# Altium schematic sheet camera.SchDoc
size A3
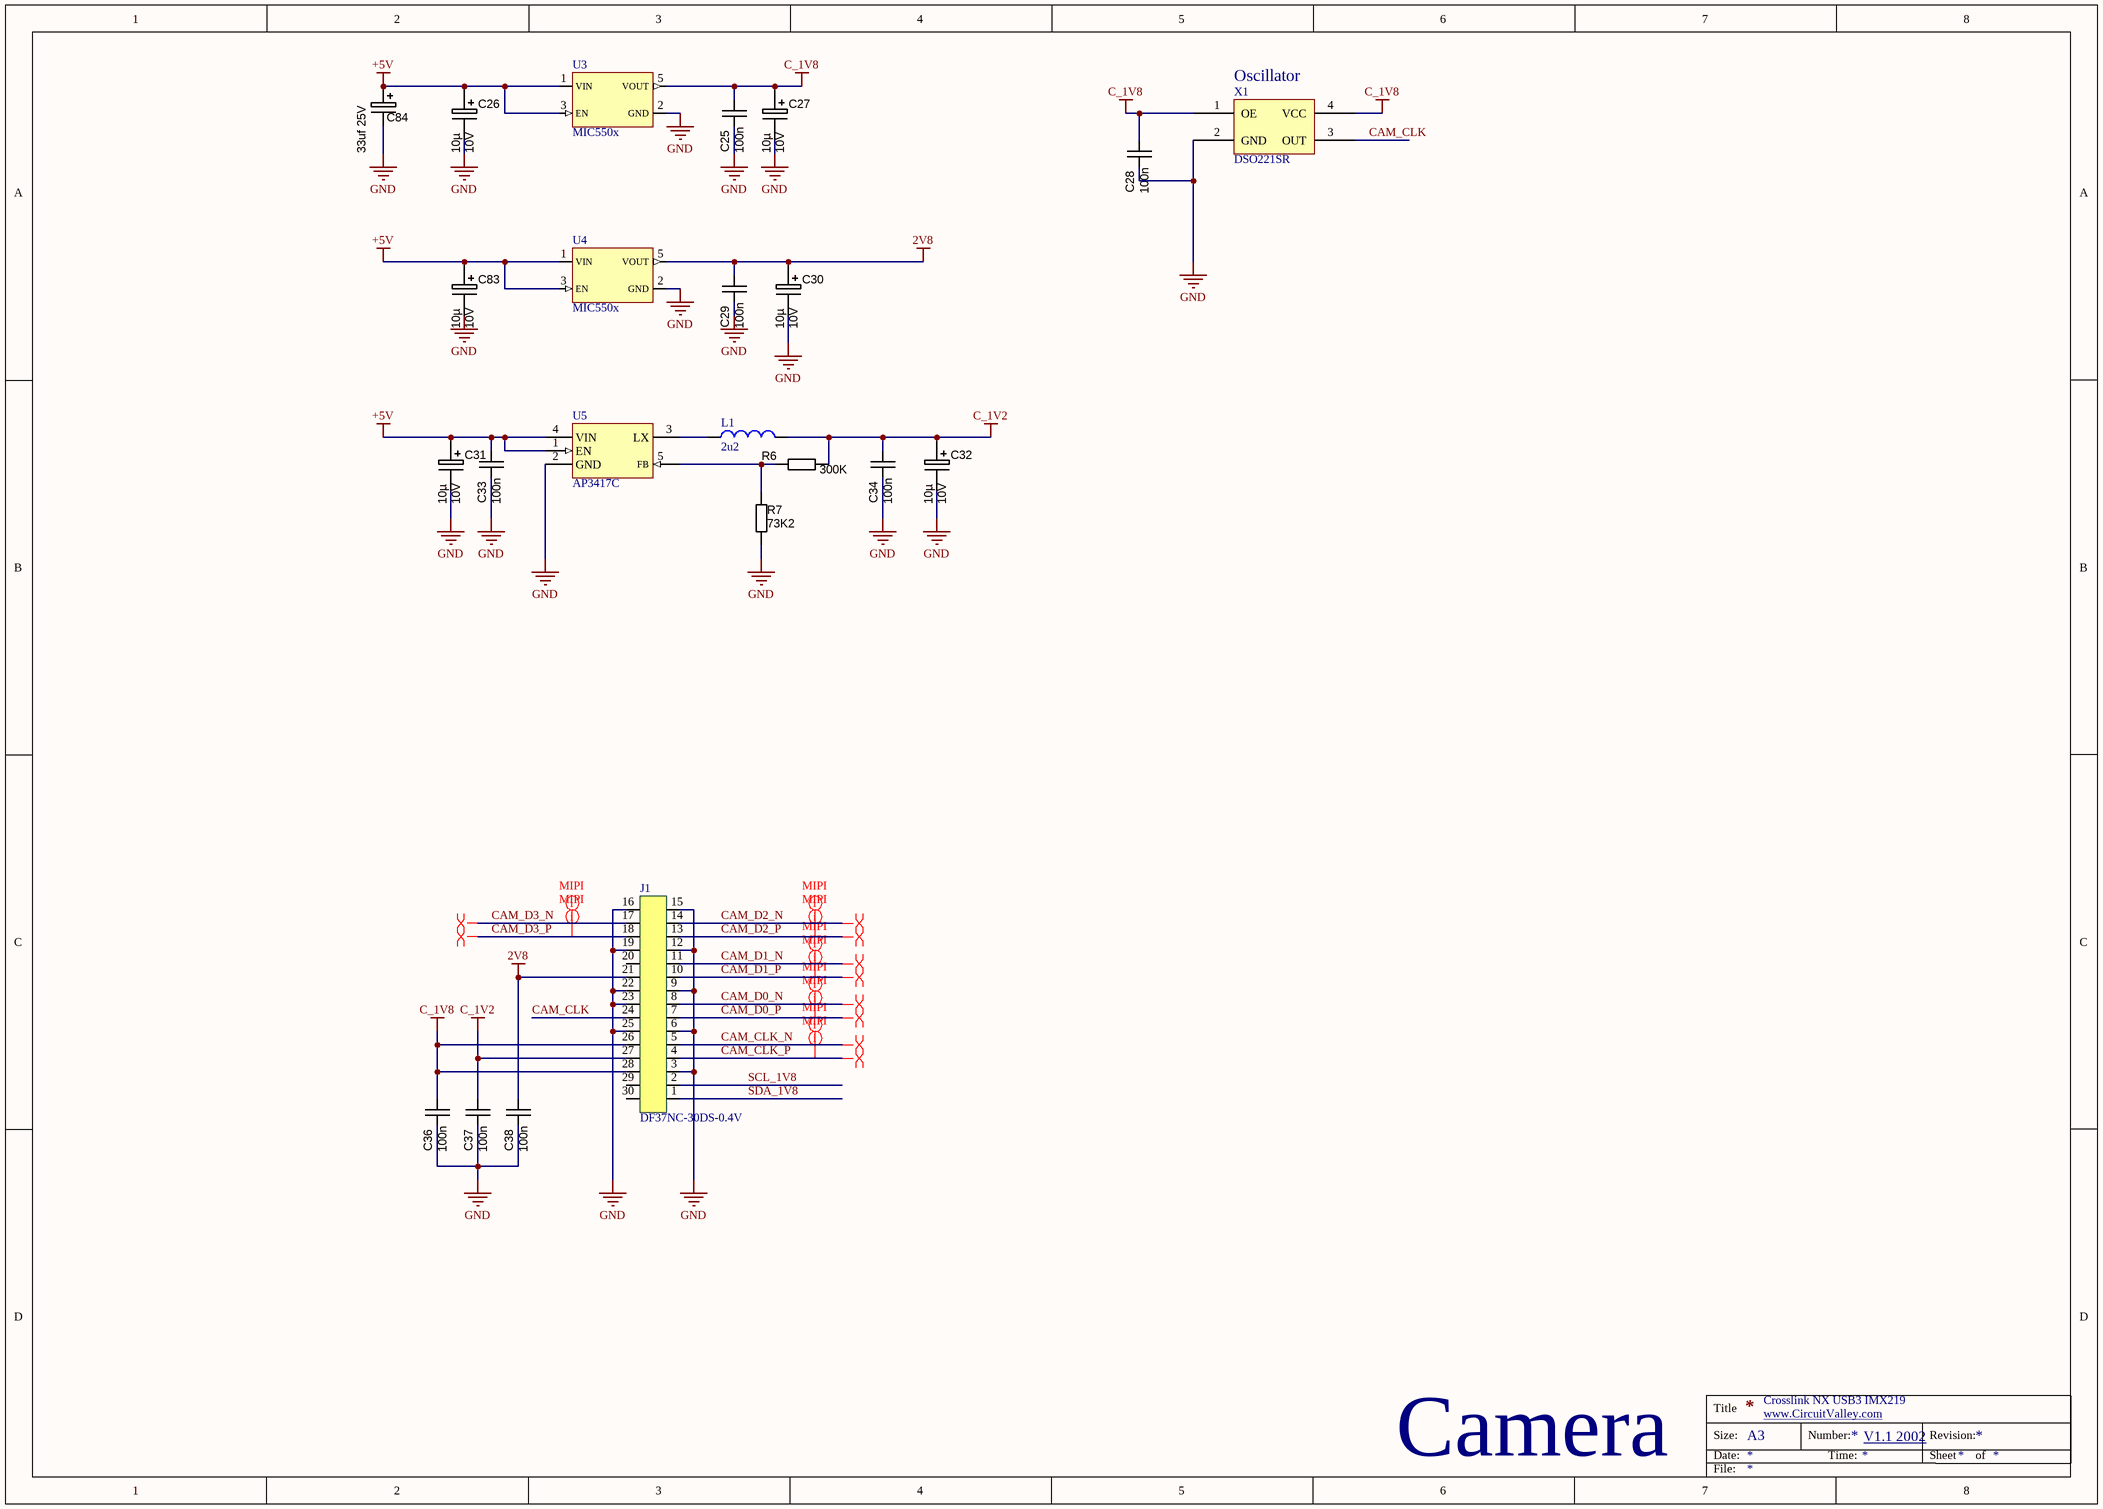
[diagram p0: camera.SchDoc]

## Parts
C25  100n  [CAPC1608N]
C26  Ratings: 10V  [CAPMP3528X210N]  (hidden comment: 10µ)
C27  Ratings: 10V  [CAPMP3528X210N]  (hidden comment: 10µ)
C28  100n  [CAPC1608N]
C29  100n  [CAPC1608N]
C30  Ratings: 10V  [CAPMP3528X210N]  (hidden comment: 10µ)
C31  Ratings: 10V  [CAPMP3528X210N]  (hidden comment: 10µ)
C32  Ratings: 10V  [CAPMP3528X210N]  (hidden comment: 10µ)
C33  100n  [CAPC1608N]
C34  100n  [CAPC1608N]
C36  100n  [CAPC1608N]
C37  100n  [CAPC1608N]
C38  100n  [CAPC1608N]
C83  Ratings: 10V  [CAPMP3528X210N]  (hidden comment: 10µ)
C84  value 33uf 25V  [CAPMP7343X310N]  (hidden comment: 33uf 20V D)
J1  DF37NC-30DS-0.4V  [DF37NC-30DS-0.4V]
L1  2u2  [TAIYO_NRS4018T2R2MDGJ]
R6  value 300K  [RESC1608N_ZERO]  (hidden comment: Thick Film)
R7  value 73K2  [RESC1608N_ZERO]  (hidden comment: Thick Film)
U3  MIC550x  [SOT23-5]
U4  MIC550x  [SOT23-5]
U5  AP3417C  [SOT23-5]
X1  DSO221SR  [Active Oscillator 2520]

## Nets
2V8: C29.2 C30.1 C38.2 J1.21 U4.5(VOUT)
+5V: C26.1 C31.1 C33.2 C83.1 C84.1 U3.1(VIN) U3.3(EN) U4.1(VIN) U4.3(EN) U5.1(EN) U5.4(VIN)
C_1V2: C32.1 C34.2 C37.2 J1.27 L1.2 R6.1
C_1V8: C25.2 C27.1 C28.2 C36.2 J1.26 J1.28 U3.5(VOUT) X1.1(OE) X1.4(VCC)
GND: C25.1 C26.2 C27.2 C28.1 C29.1 C30.2 C31.2 C32.2 C33.1 C34.1 C36.1 C37.1 C38.1 C83.2 C84.2 J1.3 J1.6 J1.9 J1.12 J1.15 J1.16 J1.19 J1.22 J1.23 J1.25 R7.2 U3.2(GND) U4.2(GND) U5.2(GND) X1.2(GND)
CAM_CLK: J1.24 X1.3(OUT)
CAM_CLK_N: J1.5
CAM_CLK_P: J1.4
CAM_D0_N: J1.8
CAM_D0_P: J1.7
CAM_D1_N: J1.11
CAM_D1_P: J1.10
CAM_D2_N: J1.14
CAM_D2_P: J1.13
CAM_D3_N: J1.17
CAM_D3_P: J1.18
SCL_1V8: J1.2
SDA_1V8: J1.1
NetL1_1: L1.1 U5.3(LX)
NetR6_2: R6.2 R7.1 U5.5(FB)

Not connected (* = marked no-connect by the designer): J1 20 29 30

## Layout directives
net class MIPI: CAM_CLK_N, CAM_CLK_P, CAM_D0_N, CAM_D0_P, CAM_D1_N, CAM_D1_P, CAM_D2_N, CAM_D2_P, CAM_D3_N, CAM_D3_P
differential pair: CAM_CLK_N, CAM_CLK_P, CAM_D0_N, CAM_D0_P, CAM_D1_N, CAM_D1_P, CAM_D2_N, CAM_D2_P, CAM_D3_N, CAM_D3_P

## Notes on the sheet
- (near X1) Oscillator
- Crosslink NX USB3 IMX219
- www.CircuitValley.com <http://www.CircuitValley.com>
- V1.1 2002
- Camera
- Title
- Size:
- Date:
- A3
- Number:
- Time:
- Revision:
- Sheet
- of
- File:

## Library data of the parts
C25 C28 C29 C33 C34 C36-C38 = CAPC_10p_0603_NP0_1%_50V: Capacitor SMD Cer 10pF 5% 50V NP0 0603; Manufacturer 1: Murata Electronics North America; Manufacturer Part Number 1: GRM1885C1H100FA01J; Part: C0603X104K5RAC; Ratings: 50V; NP0; Tolerance: ±5%; Operating Temperature: -55°C ~ 125°C; Package / Case: 0603 (1608 Metric); Size / Dimension: 0.063" L x 0.032" W (1.60mm x 0.81mm); Thickness (Max): 0.035" (0.90mm); Supplier 1: Digi-Key; Supplier Part Number 1: GRM1885C1H100FA01J-ND; Value: 100n
C26 C27 C30-C32 C83 = CAPT_47u_1210_6V3: Capacitor SMD Tantalum 47uF 20% 6.3V 1210; Manufacturer 1: AVX Corporation; Manufacturer Part Number 1: TCJB476M006R0070; Manufacturer Size Code: B; Voltage - Rated: 6V3; ESR (Equivalent Series Resistance): 70.0 mOhm; Type: Molded; Package / Case: 1210 (3528 Metric); Tolerance: ±20%; Material: Tantalum; Supplier 1: Digi-Key; Supplier Part Number 1: 478-3139-1-ND; Operating Temperature: -55°C ~ 125°C; Size / Dimension: 0.138" L x 0.110" W (3.50mm x 2.80mm); Height - Seated (Max): 0.083" (2.10mm); ComponentLink1URL: http://www.avx.com/docs/Catalogs/tcj.pdf; ComponentLink1Description: http://www.avx.com/docs/Catalogs/tcj.pdf; Value: 10µ
C84 = CAPT_330u_2917_6V3: Capacitor SMD Tant 330uF 20% 6V3 2917; Manufacturer Part Number: T520D337M006ATE015; Part: TAJD336K020R; Ratings: 6.3V; Material: Solid Tantalum; ESR (Equivalent Series Resistance): 15 mOhm; Package / Case: 2917 (7343 Metric); Tolerance: ±20%; Operating Temperature: -55°C ~ 125°C; Size / Dimension: 0.287" L x 0.169" W (7.30mm x 4.30mm); Height - Seated (Max): 0.122" (3.10mm); Manufacturer Size Code: D; Supplier 1: Digi-Key; Supplier Part Number 1: 399-4052-1-ND; ComponentLink1URL: http://www.kemet.com/datasheets&T520D337M006ATE015; ComponentLink1Description: T520D Datasheet
J1 = 30_Pin_Dual
L1 = inductor_smd: PartNumber: NRS4018T2R2MDGJ
R6 R7 = RES_0R_0603: Resistor SMD chip 0.0 Ohm 0.1W 0603; Manufacturer 1: Vishay/Dale; Manufacturer Part Number 1: CRCW06030000Z0EA; Tolerance: ±5%; Ratings: 1/10W; Package / Case: 0603 (1608metric); Supplier 1: Digi-Key; Supplier Part Number 1: 541-0.0GCT-ND
X1 = Oscillator_2520: Active Oscillator_2520